# Altium schematic sheet NRF24L01.SchDoc
size A4
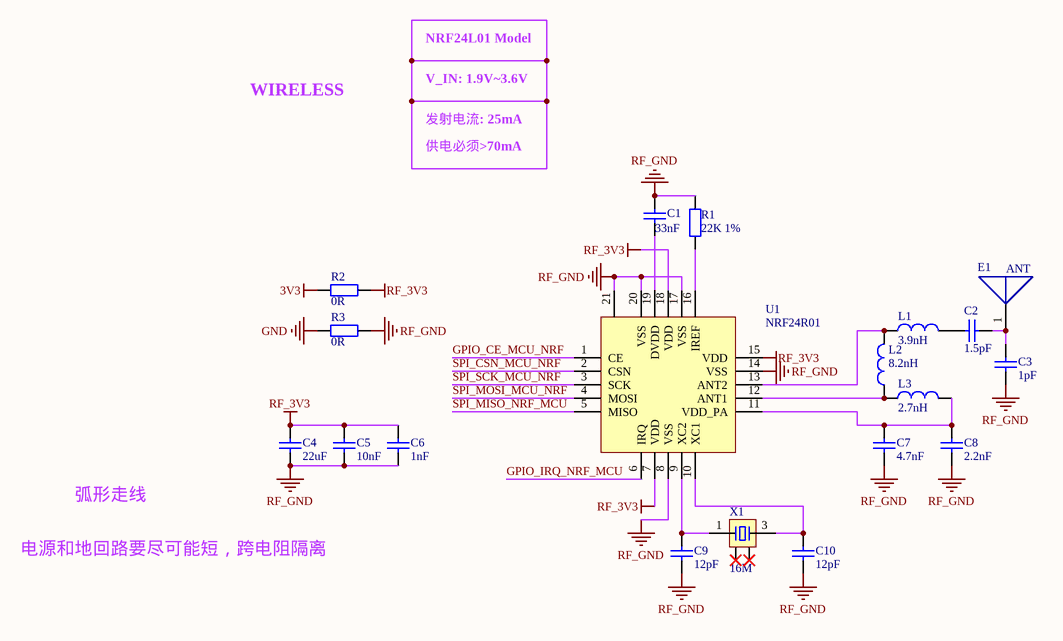
[diagram p0: NRF24L01.SchDoc]

## Parts
C1  33nF  [Cap-0603]
C2  1.5pF  [Cap-0402]
C3  1pF  [Cap-0402]
C4  22uF  [Cap-0805]
C5  10nF  [Cap-0603]
C6  1nF  [Cap-0603]
C7  4.7nF  [Cap-0402]
C8  2.2nF  [Cap-0402]
C9  12pF  [Cap-0603]
C10  12pF  [Cap-0603]
E1  ANT  [AN2051-245]
L1  3.9nH  [L-0402]
L2  8.2nH  [L-0402]
L3  2.7nH  [L-0402]
R1  22K 1%  [Res-0603]
R2  0R  [Res-0603]
R3  0R  [Res-0603]
U1  NRF24R01  [QFN20 4x4]
X1  16M  [OSC 3225-4P]

## Nets
3V3: R2.1
GND: R3.1
RF_3V3: C4.1 C5.2 C6.2 R2.2 U1.7(VDD) U1.15(VDD) U1.18(VDD)
RF_GND: C1.1 C3.1 C4.2 C5.1 C6.1 C7.1 C8.1 C9.1 C10.1 R1.1 R3.2 U1.8(VSS) U1.14(VSS) U1.17(VSS) U1.20(VSS) U1.21
GPIO_CE_MCU_NRF: U1.1(CE)
GPIO_IRQ_NRF_MCU: U1.6(IRQ)
SPI_CSN_MCU_NRF: U1.2(CSN)
SPI_MISO_NRF_MCU: U1.5(MISO)
SPI_MOSI_MCU_NRF: U1.4(MOSI)
SPI_SCK_MCU_NRF: U1.3(SCK)
NetC1_2: C1.2 U1.19(DVDD)
NetC2_1: C2.1 L1.2
NetC2_2: C2.2 C3.2 E1.1
NetC7_2: C7.2 C8.2 L3.2 U1.11(VDD_PA)
NetC9_2: C9.2 U1.9(XC2) X1.1
NetC10_2: C10.2 U1.10(XC1) X1.3
NetL1_1: L1.1 L2.2 U1.13(ANT2)
NetL2_1: L2.1 L3.1 U1.12(ANT1)
NetR1_2: R1.2 U1.16(IREF)

Not connected (* = marked no-connect by the designer): X1 2* 4*

## Notes on the sheet
- NRF24L01 Model
- WIRELESS
- V_IN: 1.9V~3.6V
- 发射电流: 25mA
- 供电必须>70mA
- 弧形走线
- 电源和地回路要尽可能短，跨电阻隔离

## Library data of the parts
C1-C10 = CAP: 贴片陶瓷电容
L1-L3 = INDUCTOR: 贴片电感
R1-R3 = RES: 贴片电阻
U1 = NRF24R01: 2.4G无线
X1 = XTAL-4P: 4脚无源晶振
E1 = ANT: Published: 12-August-2017; Publisher: mazhongwei; PackageReference: R_1206